# EAGLE schematic baskettarget (EAGLE 9.6.2)
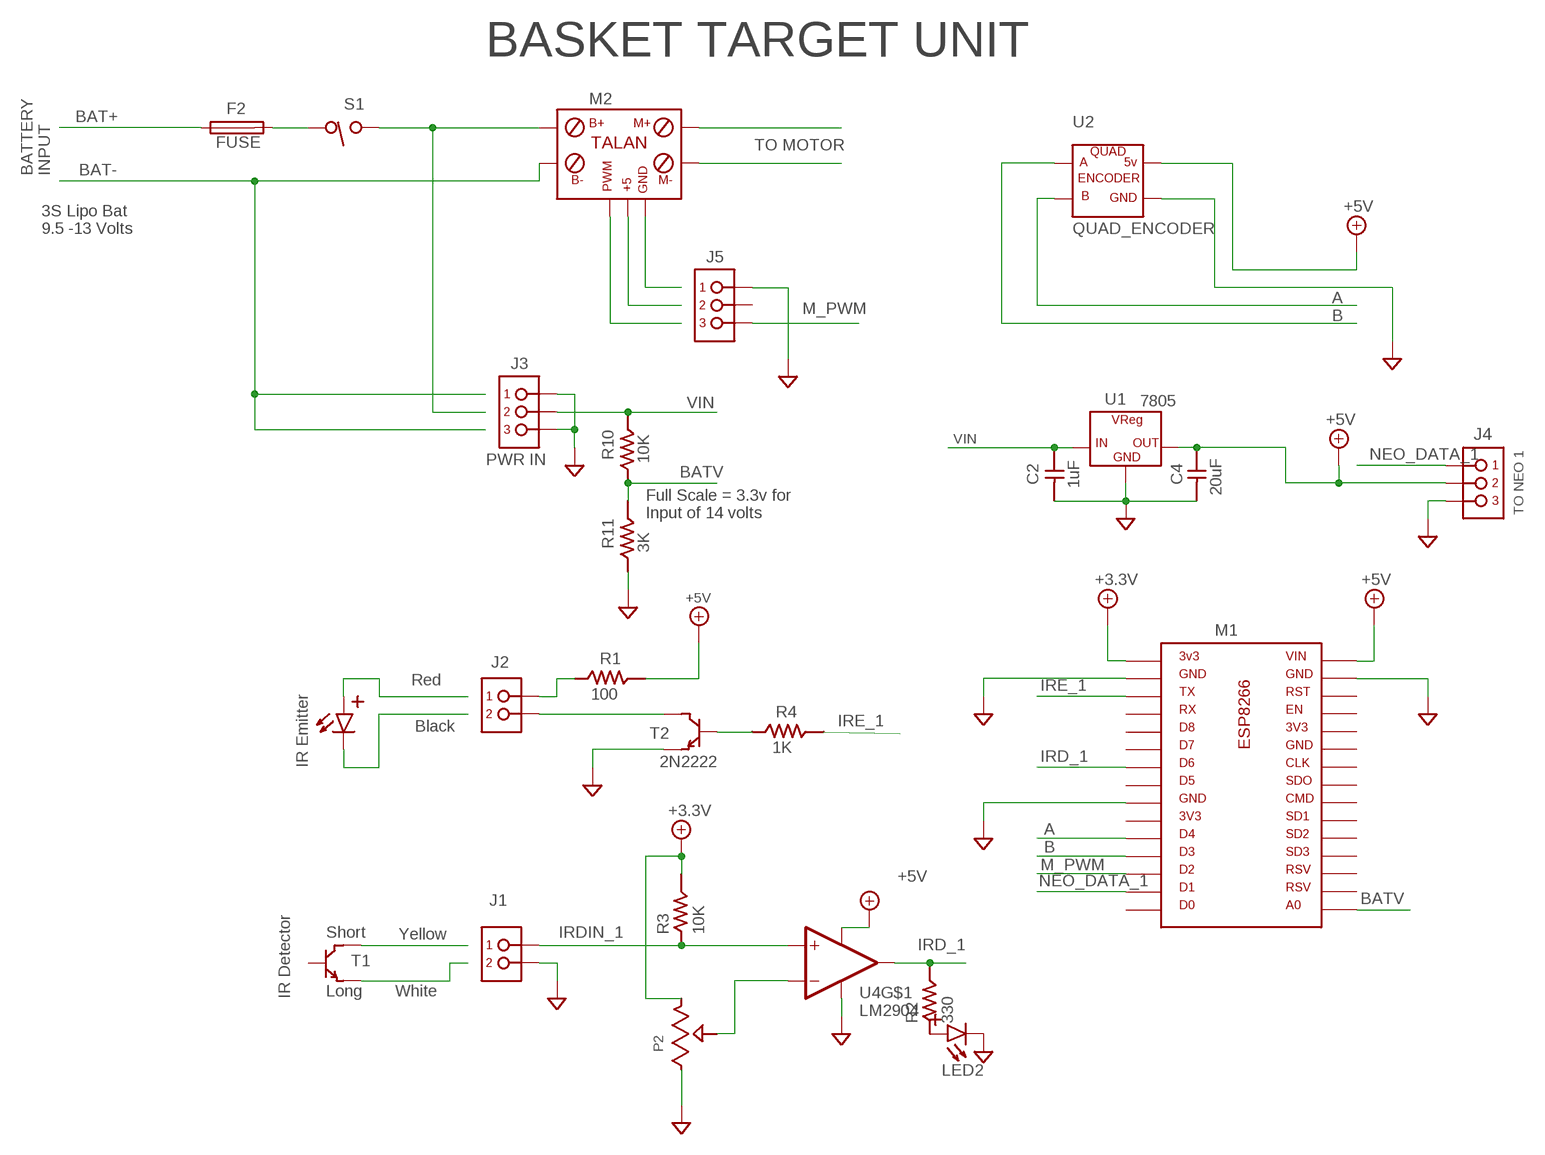
[diagram p0: schematic, sheet 1]

## Parts
C2  1uF  CAP200  [CAP200]
C4  20uF  CAP200  [CAP200]
F2  FUSE  FUSE19596  [FUSE_HOLDER_WICKMANN-19596]
J1  PINHDR_1X2-JST  [JST-XH_098_VERT_1X2]
J2  PINHDR_1X2-JST  [JST-XH_098_VERT_1X2]
J3  PINHDR_1X3XH-JST  [JST-XH_098_VERT_1X3]
J4  PINHDR_1X3XH-JST  [JST-XH_098_VERT_1X3]
J5  PINHDR_1X3XH-JST  [JST-XH_098_VERT_1X3]
LED1  LEDTH-DIP-100  [LED-TH100]
LED2  LEDTH-DIP-100  [LED-TH100]
M1  ESP8266_MODULE  [ESP8266_MODULE]
M2  TALAN  [TALAN_PWM]
P2  TRIMPOT-SIP  [TRIMPOT_SIP_100]
R1  100  RTHOLE300  [R300]
R2  330  RTHOLE300  [R300]
R3  10K  RTHOLE300  [R300]
R4  1K  RTHOLE300  [R300]
R10  10K  RTHOLE300  [R300]
R11  3K  RTHOLE300  [R300]
S1  TOGGLE_SWITCH_SPST  [SPST_TOGGLE]
T1  T_NPN  [TO-92]
T2  2N2222  T_NPN  [TO-92]
U1  7805  VREG-3-DIP  [PINHDR_TH_100_1X3]
U2  QUAD_ENCODER  [QUAD_ENCODER]
U4  LM2904  [DIP8]

## Nets
+3.3V: M1.P$1 P2.P$3 R3.P$2
+5V: C4.2 J4.2 M1.P$30 R1.P$2 U1.3(OUT) U2.5V U4.P$8(P+)
A: M1.P$11 U2.B
B: M1.P$12 U2.A
BAT+: F2.A
BAT-: M2.B-
BATV: M1.P$16 R10.P$1 R11.P$2
GND: C2.1 C4.1 J1.2 J3.1 J3.3 J4.1 J5.3 LED2.P$2(CATHODE) M1.P$2 M1.P$9 M1.P$29 P2.P$1 R11.P$1 T2.P$3(EMITTER) U1.2(GND) U2.GND U4.P$4(P-)
IRD_1: M1.P$7 R2.P$2 U4.P$1(OUT)
IRDIN_1: J1.1 R3.P$1 U4.P$3(+IN)
IRE_1: M1.P$3 R4.P$2
M_PWM: J5.1 M1.P$13
N$1: LED1.P$2(CATHODE)
N$2: LED1.P$1(ANODE)
N$3: J2.1 R1.P$1
N$4: LED2.P$1(ANODE) R2.P$1
N$5: P2.P$2 U4.P$2(-IN)
N$6: T1.P$1(COLLECTOR)
N$7: T1.P$3(EMITTER)
N$11: M2.M+
N$12: M2.GND
N$13: F2.B S1.P$1
N$14: M2.B+ S1.P$3
N$15: M2.M-
N$16: M2.5V
N$17: M2.PWM
N$22: J2.2 T2.P$1(COLLECTOR)
N$23: R4.P$1 T2.P$2(BASE)
NEO_DATA_1: J4.3 M1.P$14
VIN: C2.2 J3.2 R10.P$2 U1.1(IN)
Unconnected: J5.2 M1.P$4 M1.P$5 M1.P$6 M1.P$8 M1.P$10 M1.P$15 M1.P$17 M1.P$18 M1.P$19 M1.P$20 M1.P$21 M1.P$22 M1.P$23 M1.P$24 M1.P$25 M1.P$26 M1.P$27 M1.P$28 S1.P$2 T1.P$2(BASE) U4.P$5(+IN) U4.P$6(-IN) U4.P$7(OUT)

## Notes on the sheet
- BASKET TARGET UNIT
- TO MOTOR
- BATTERY
  INPUT
- 3S Lipo Bat
  9.5 -13 Volts
- PWR IN
- TO NEO 1
- Full Scale = 3.3v for 
  Input of 14 volts
- Red
- Black
- IR Emitter
- Short | Yellow
- IR Detector | Long | White

## Library data of the parts
C2 C4 = Dal_V2:CAP
F2 = fuse:FUSE: Fuse; OC_FARNELL: 1271669; OC_NEWARK: unknown
J1 J2 = Dal_V2:PINHDR_1X2
J3-J5 = Dal_V2:PINHDR_1X3
LED1 LED2 = Dal_V2:LED: Standard LED
M1 = Dal_V2:ESP8266_MODULE
M2 = Dal_V2:TALAN
P2 = Dal_V2:TRIMPOT
R1-R4 R10 R11 = Dal_V2:R: Standard Resistor -- Various Sizes and Wattages
S1 = Dal_V2:TOGGLE_SWITCH_SPST
T1 T2 = Dal_V2:T_NPN
U1 = Dal_V2:VREG-3: 3 Pin Voltage Regulator
U2 = Dal_V2:QUAD_ENCODER
U4 = Dal_V2:LM2904